# EAGLE board LSS Pro V0.2 BOTTOM (EAGLE 7.6.0)
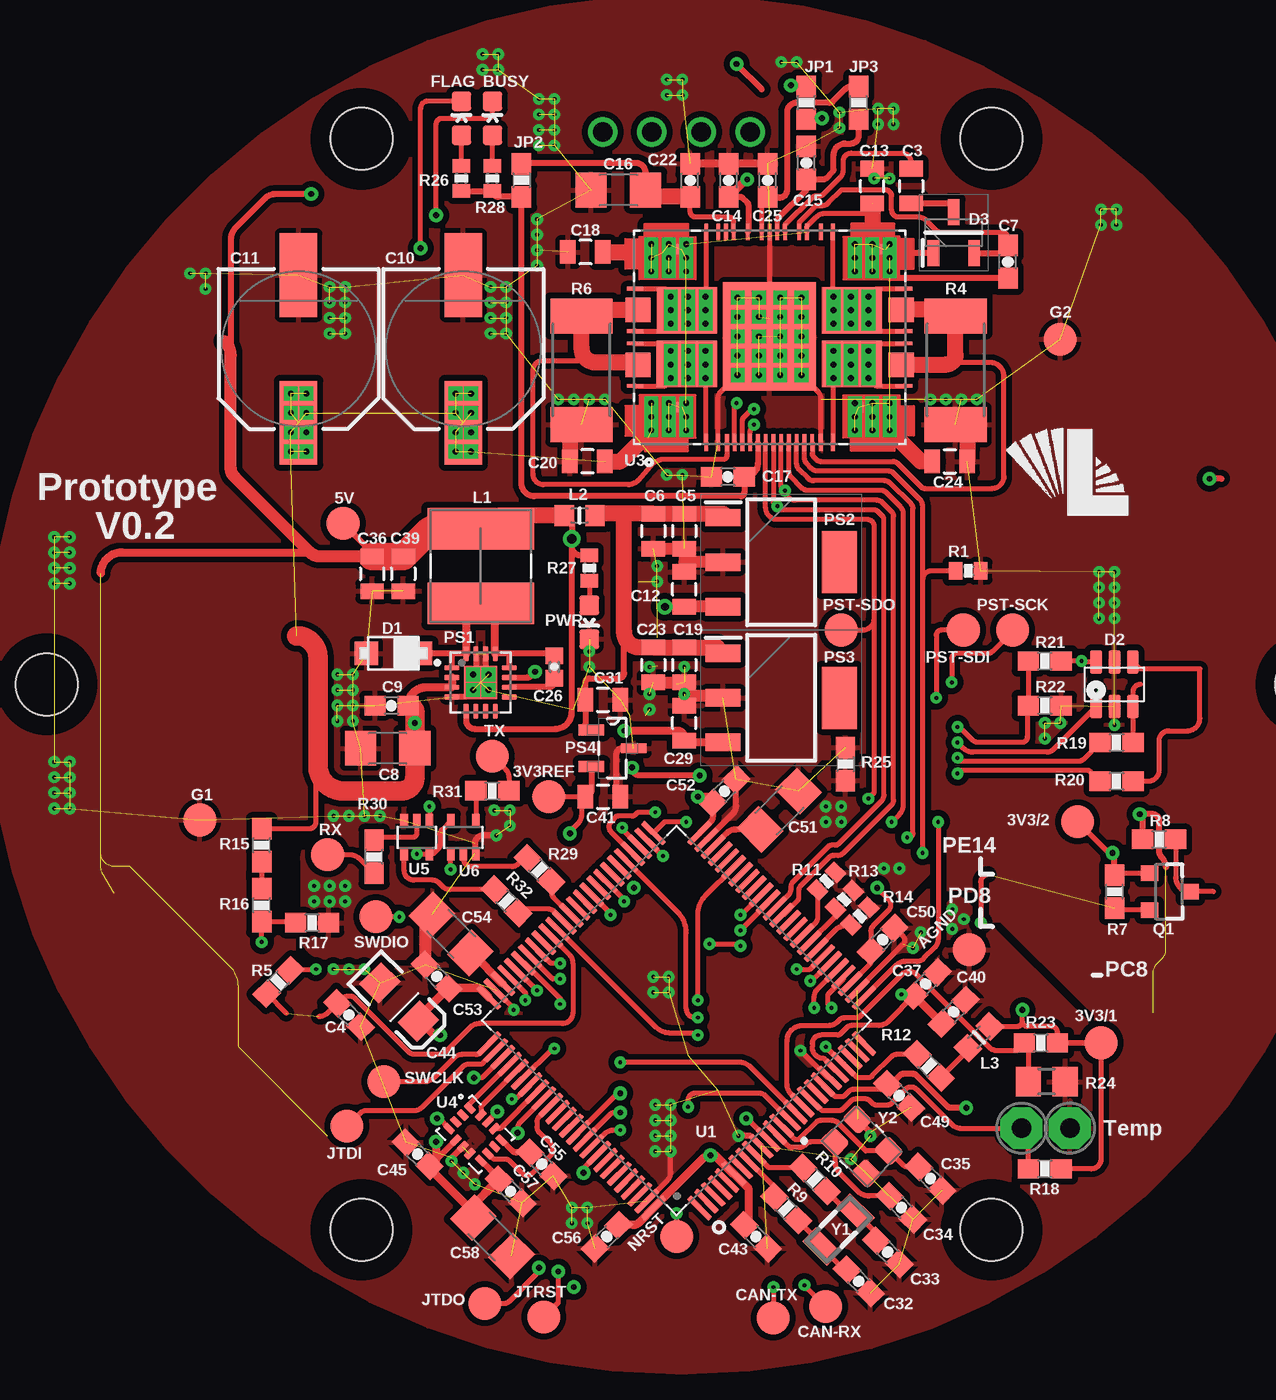
[diagram p2: board, top side]
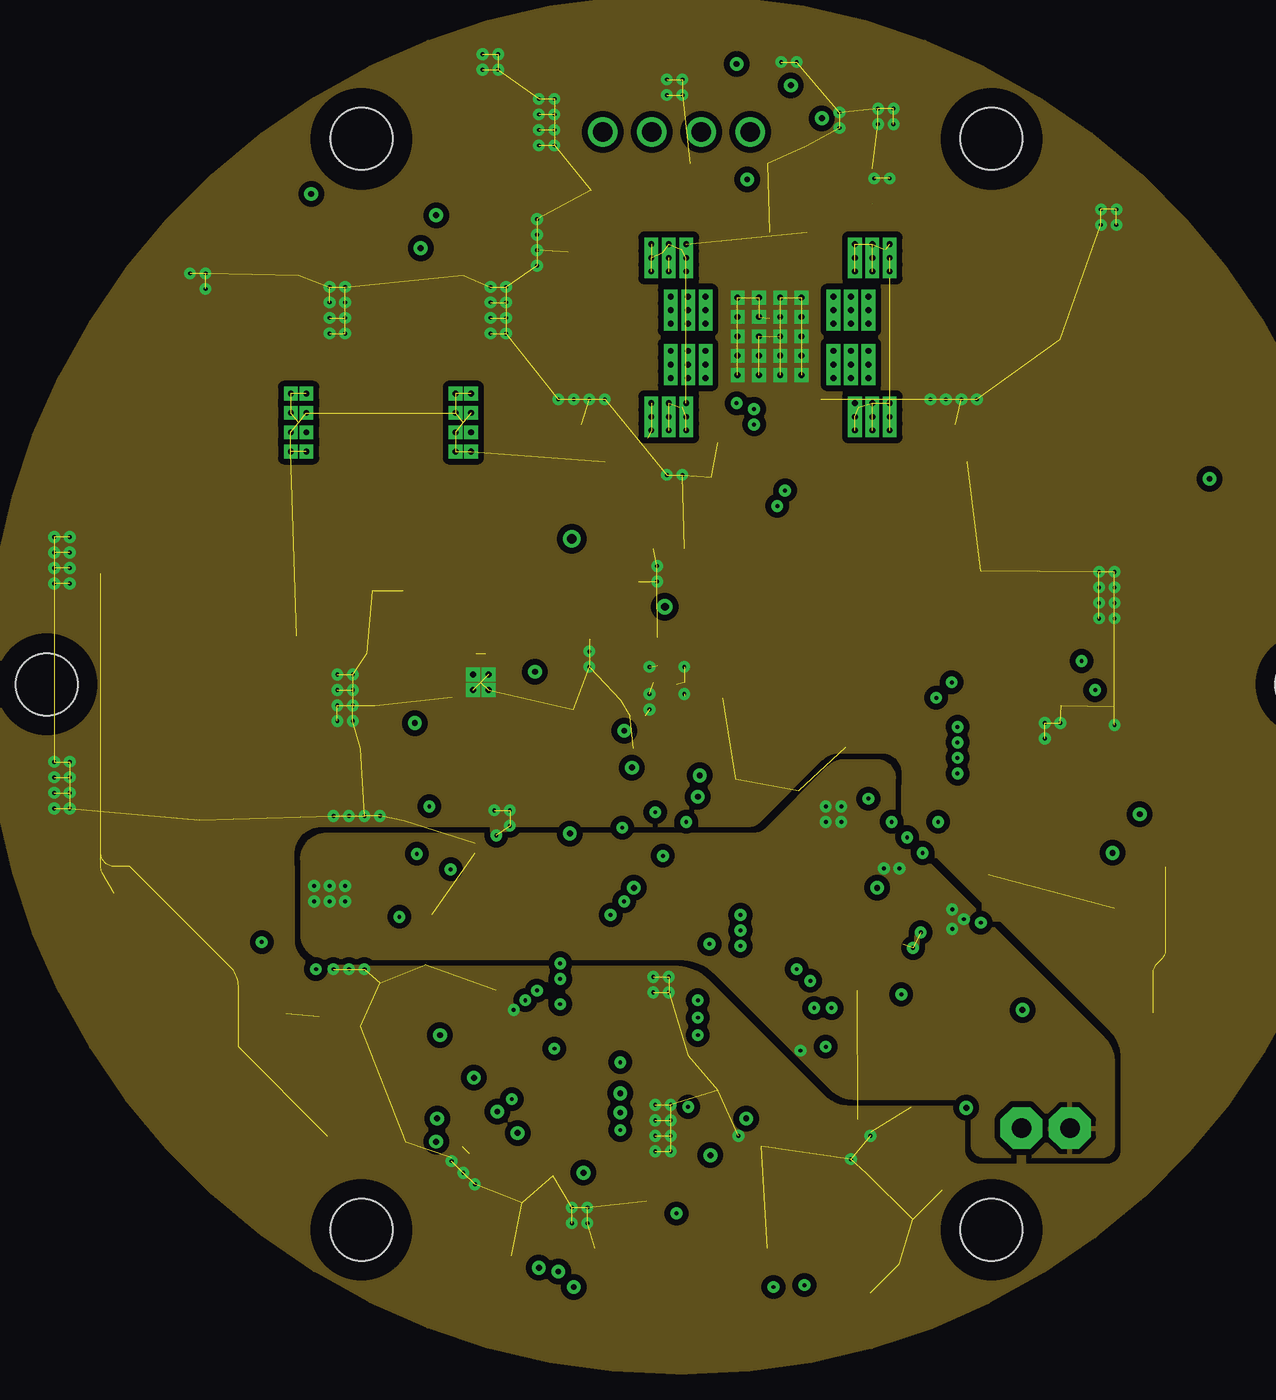
[diagram p3: board, inner layer Route2]
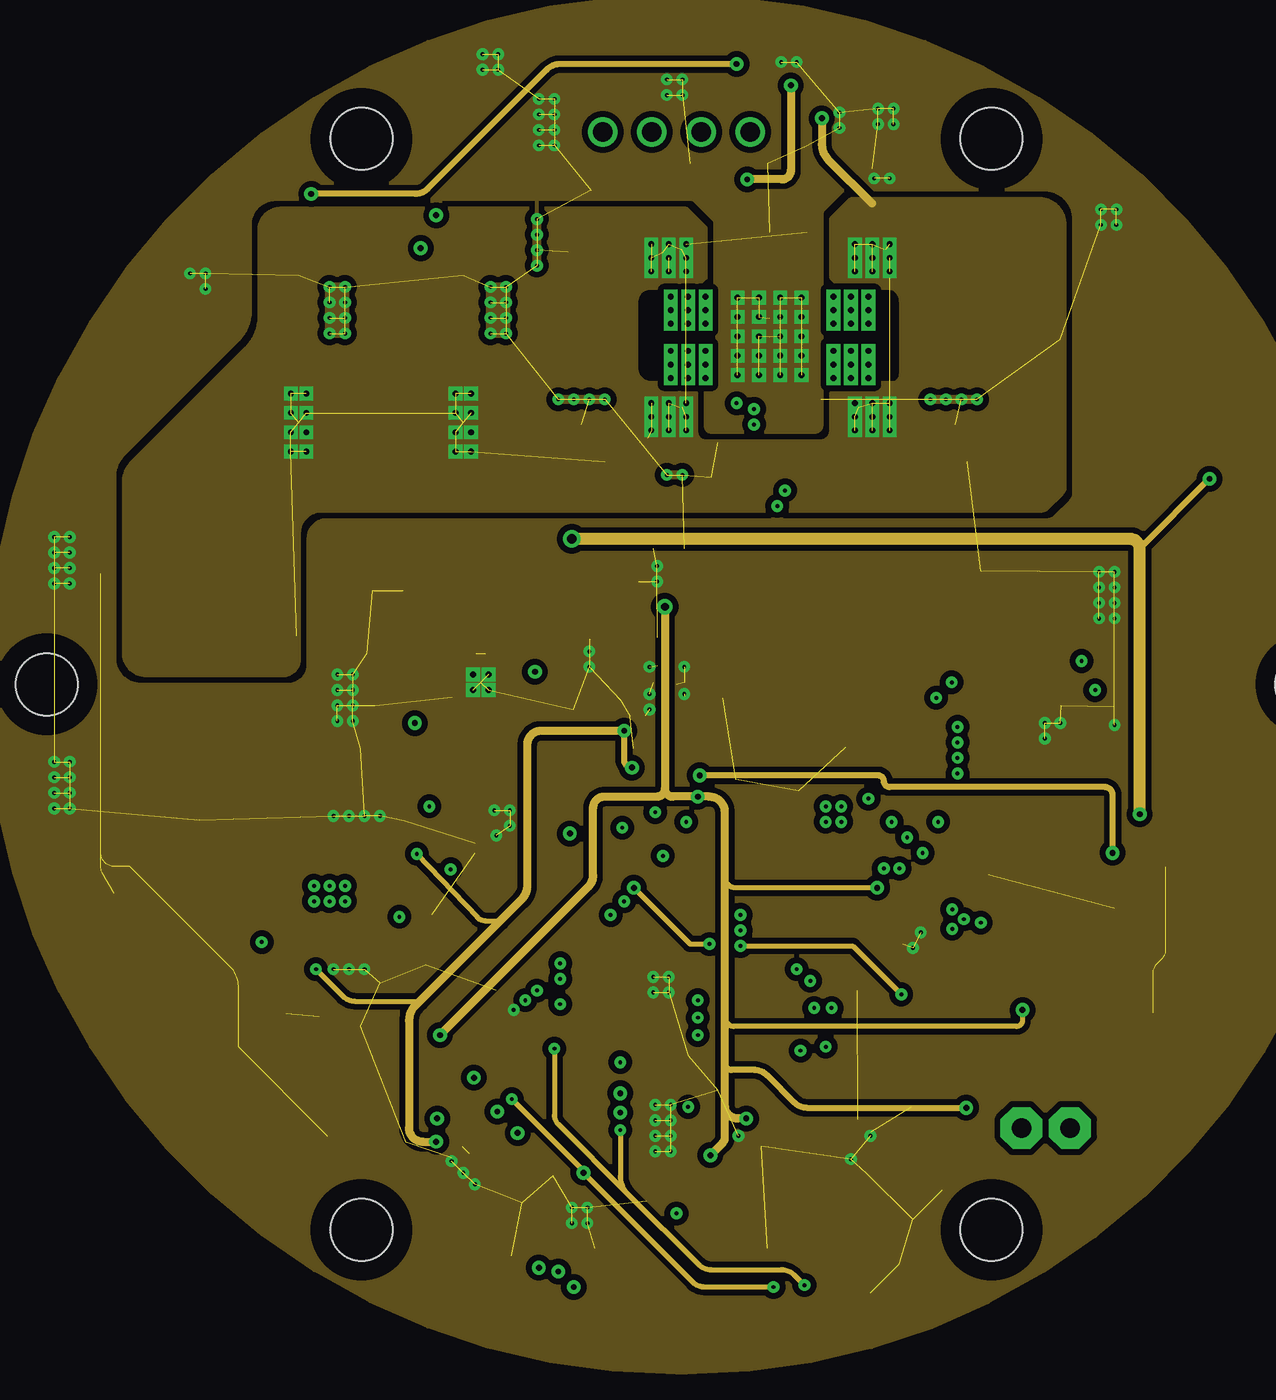
[diagram p4: board, inner layer Route15]
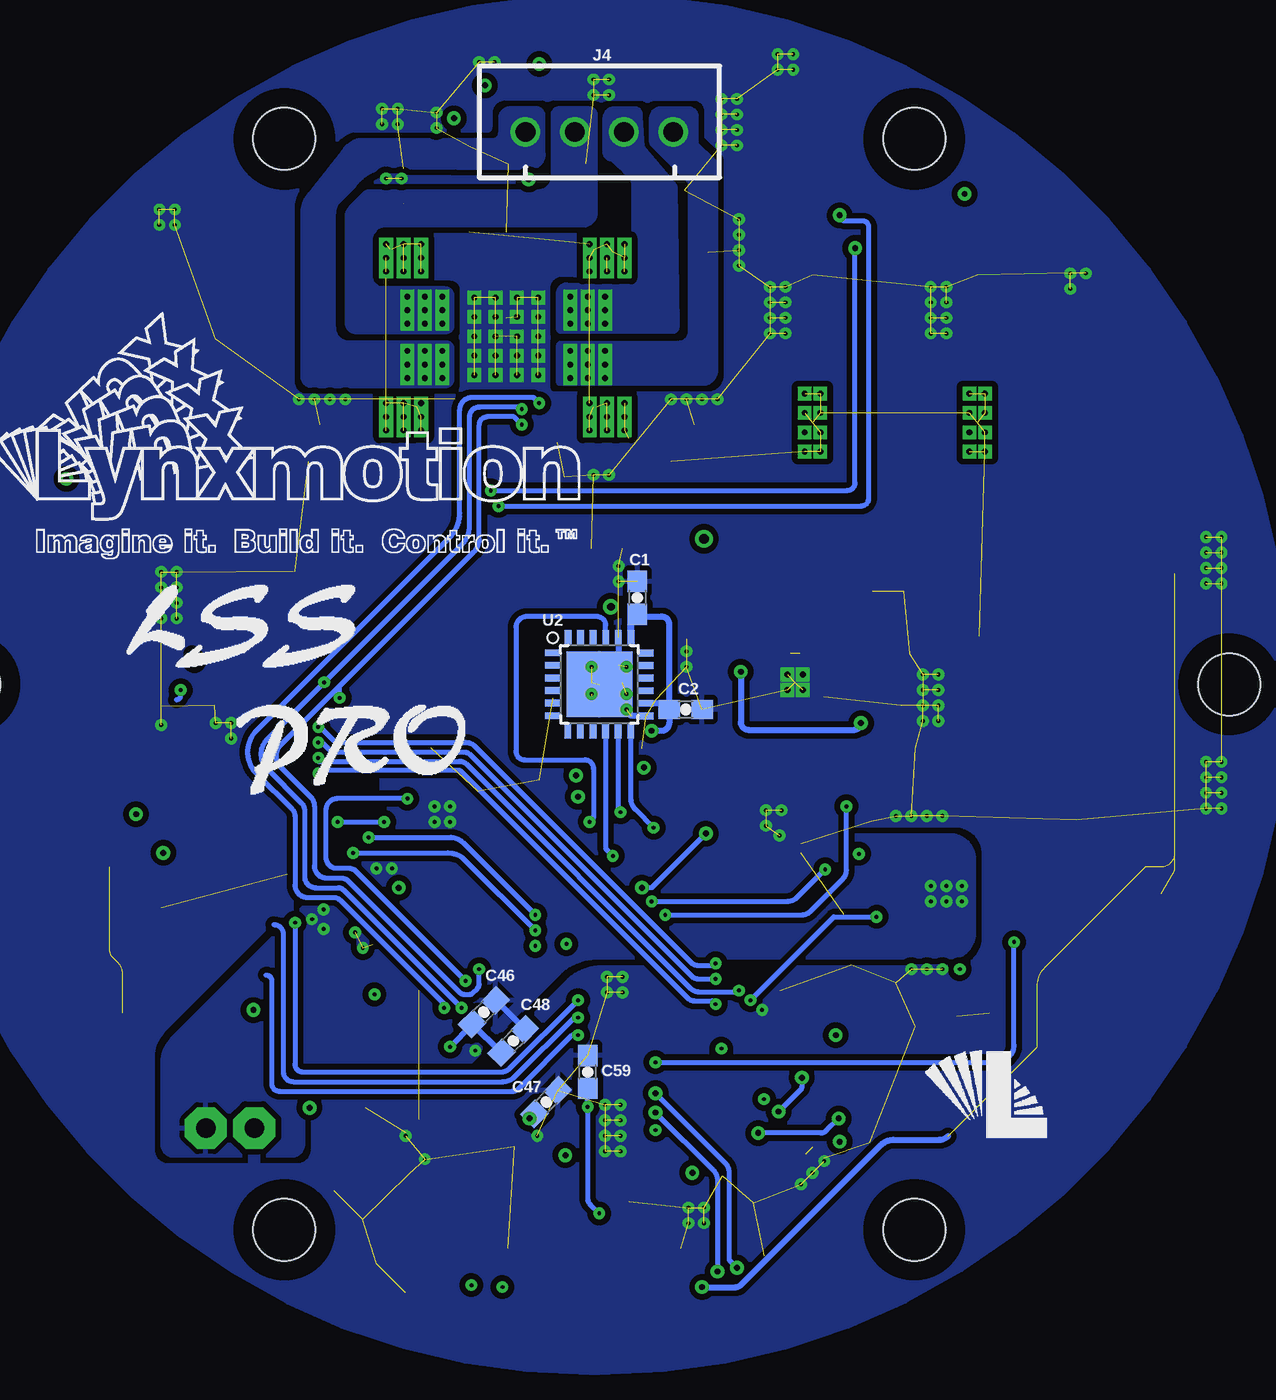
[diagram p5: board, bottom side, seen from below]

No outline drawn. Coordinates in mm, seen from the top.
Copper layers ((1*2)*(15*16)): Top 0.035mm / dielectric 0.2352mm / Route2 0.035mm / dielectric 38mil / Route15 0.035mm / dielectric 0.2352mm / Bottom 0.035mm
Design rules "default *": minimum track width 10mil, minimum drill 0.2mm, track to track 0.1mm, track to pad 0.1mm, pad to pad 0.1mm, via to via 0.1mm, smd to smd 0.1mm, copper to edge 40mil, drill to drill 8mil, minimum pad ring 10mil, minimum via ring 8mil, stop-mask expansion 4mil, vias tented up to drill 25mil, thermal gap 10mil
Net classes: 1 vcc: width 0.305 mm; 2 Power: width 0.203 mm, drill 0.305 mm, clearance 0.152 mm to class 0, clearance 0.152 mm to class 1, clearance 0.152 mm; 3 usb diff pairs: width 0.254 mm
Holes 3.2 mm at 51.75,63.65 19.25,63.65 19.25,7.35 51.75,7.35 3,35.5 68,35.5
tRestrict: 1 lines

## Footprints (pad centres in the part's own frame; a part is rotated, then mirrored left to right if it is on the bottom)
TP17R = smd 1.7 x 1.7: TP 0,0
TP-040 = drill 1.016 pad 2.159 octagon: 1 0,0
LED-0603 = smd 1 x 1: A 0,-0.877; C 0,0.877
0603-CAP = smd 1.1 x 1: 1 -0.85,0; 2 0.85,0
0805 = smd 0.8 x 1.2: 1 -0.9,0; 2 0.9,0
1206 = smd 1.6 x 1.8: 1 -1.4,0; 2 1.4,0
CSV-E/F = smd 4.318 x 1.93: + -3.81,0; - 3.81,0
0402-CAP = smd 0.85 x 0.9: 1 -0.58,0; 2 0.58,0
EIA3216 = smd 1.4 x 1.6: A 1.4,0; C -1.4,0
SOD123W = smd 1.2 x 1.2: 1 -1.4,0; 2 1.4,0
SOT-23-6L = smd 0.6 x 1.2: 1 -0.95,-1.15; 2 0,-1.15; 3 0.95,-1.15; 4 0.95,1.15; 5 0,1.15; 6 -0.95,1.15
SOT105P242X150-3N = smd 1.35 x 0.6: 1 -1.05,1.05; 2 -1.05,-1.05; 3 1.05,0
JST-XH-04-PACKAGE-ROUND-PAD = drill 1.016: 1 -3.81,0; 2 -1.27,0; 3 1.27,0; 4 3.81,0
0603-RES = smd 1.1 x 1: 1 -0.85,0; 2 0.85,0
WE-PD2_5848/5820 = smd 2.15 x 5.5: 1 -1.925,0; 2 1.925,0
L0603 = smd 1 x 1.1: 1 -0.794,0; 2 0.794,0
QFN16 = smd 0.76 x 0.26: 1 -1.485,0.75; 2 -1.485,0.25; 3 -1.485,-0.25; 4 -1.485,-0.75; 9 1.485,-0.75; 10 1.485,-0.25; 11 1.485,0.25; 12 1.485,0.75 | smd 0.26 x 0.76: 5 -0.75,-1.485; 6 -0.25,-1.485; 7 0.25,-1.485; 8 0.75,-1.485; 13 0.75,1.485; 14 0.25,1.485; 15 -0.25,1.485; 16 -0.75,1.485 | smd 1.7 x 1.7: 17 0,0
SOT230P700X165-4N = smd 1.8 x 0.9: 1 -3,2.3; 2 -3,0; 3 -3,-2.3 | smd 1.8 x 3.2: 4 3,0
SOT95P237X112-3N = smd 1.321 x 0.559: 1 -1.092,0.94; 2 -1.092,-0.94 | smd 1.321 x 0.508: 3 1.092,0
SOT23-3 = smd 0.8 x 0.9: 1 -0.95,-1; 2 0.95,-1; 3 0,1.1
0402-RES = smd 0.7 x 0.9: 1 -0.65,0; 2 0.65,0
R2512 = smd 1.8 x 3.2: 1 -2.8,0; 2 2.8,0
R0805 = smd 1.3 x 1.5: 1 -0.95,0; 2 0.95,0
LQFP100 = smd 1.56 x 0.28: 1 -7.68,6; 2 -7.68,5.5; 3 -7.68,5; 4 -7.68,4.5; 5 -7.68,4; 6 -7.68,3.5; 7 -7.68,3; 8 -7.68,2.5; 9 -7.68,2; 10 -7.68,1.5; 11 -7.68,1; 12 -7.68,0.5; 13 -7.68,0; 14 -7.68,-0.5; 15 -7.68,-1; 16 -7.68,-1.5; 17 -7.68,-2; 18 -7.68,-2.5; 19 -7.68,-3; 20 -7.68,-3.5; 21 -7.68,-4; 22 -7.68,-4.5; 23 -7.68,-5; 24 -7.68,-5.5; 25 -7.68,-6; 51 7.68,-6; 52 7.68,-5.5; 53 7.68,-5; 54 7.68,-4.5; 55 7.68,-4; 56 7.68,-3.5; 57 7.68,-3; 58 7.68,-2.5; 59 7.68,-2; 60 7.68,-1.5; 61 7.68,-1; 62 7.68,-0.5; 63 7.68,0; 64 7.68,0.5; 65 7.68,1; 66 7.68,1.5; 67 7.68,2; 68 7.68,2.5; 69 7.68,3; 70 7.68,3.5; 71 7.68,4; 72 7.68,4.5; 73 7.68,5; 74 7.68,5.5; 75 7.68,6 | smd 0.28 x 1.56: 26 -6,-7.68; 27 -5.5,-7.68; 28 -5,-7.68; 29 -4.5,-7.68; 30 -4,-7.68; 31 -3.5,-7.68; 32 -3,-7.68; 33 -2.5,-7.68; 34 -2,-7.68; 35 -1.5,-7.68; 36 -1,-7.68; 37 -0.5,-7.68; 38 0,-7.68; 39 0.5,-7.68; 40 1,-7.68; 41 1.5,-7.68; 42 2,-7.68; 43 2.5,-7.68; 44 3,-7.68; 45 3.5,-7.68; 46 4,-7.68; 47 4.5,-7.68; 48 5,-7.68; 49 5.5,-7.68; 50 6,-7.68; 76 6,7.68; 77 5.5,7.68; 78 5,7.68; 79 4.5,7.68; 80 4,7.68; 81 3.5,7.68; 82 3,7.68; 83 2.5,7.68; 84 2,7.68; 85 1.5,7.68; 86 1,7.68; 87 0.5,7.68; 88 0,7.68; 89 -0.5,7.68; 90 -1,7.68; 91 -1.5,7.68; 92 -2,7.68; 93 -2.5,7.68; 94 -3,7.68; 95 -3.5,7.68; 96 -4,7.68; 97 -4.5,7.68; 98 -5,7.68; 99 -5.5,7.68; 100 -6,7.68
QFN24 = smd 0.8 x 0.35: 1 -2.4,1.63; 2 -2.4,0.98; 3 -2.4,0.33; 4 -2.4,-0.32; 5 -2.4,-0.97; 6 -2.4,-1.62; 13 2.4,-1.63; 14 2.4,-0.98; 15 2.4,-0.33; 16 2.4,0.32; 17 2.4,0.97; 18 2.4,1.62 | smd 0.35 x 0.8: 7 -1.63,-2.4; 8 -0.98,-2.4; 9 -0.33,-2.4; 10 0.32,-2.4; 11 0.97,-2.4; 12 1.62,-2.4; 19 1.63,2.4; 20 0.98,2.4; 21 0.33,2.4; 22 -0.32,2.4; 23 -0.97,2.4; 24 -1.62,2.4 | smd 3.4 x 3.4: 25 0,0
IC_POWERSTEP01 = smd 0.5 x 0.5: 1 -3.6,4.65; 23 -3.6,-4.6; 43 4.55,-5.9; 66 4.55,4.6 | smd 0.86 x 0.19: 7 -5.435,3.27; 8 -5.435,2.65; 9 -5.435,2.2; 10 -5.435,1.8; 11 -5.435,1.4; 12 -5.435,1; 13 -5.435,0.6; 14 -5.435,0.2; 15 -5.435,-0.2; 16 -5.435,-0.6; 17 -5.435,-1; 18 -5.435,-1.4; 19 -5.435,-1.8; 20 -5.435,-2.2; 21 -5.435,-2.65; 22 -5.435,-3.27; 53 5.435,-3.27; 54 5.435,-2.65; 55 5.435,-1.93; 56 5.435,-1.53; 57 5.435,-0.8; 58 5.435,-0.4; 59 5.435,0; 60 5.435,0.4; 61 5.435,1.13; 62 5.435,1.85; 63 5.435,2.25; 64 5.435,2.65; 65 5.435,3.27 | smd 0.19 x 0.86: 33 -2.51,-6.935; 37 -0.32,-6.935; 38 0.32,-6.935; 42 2.51,-6.935; 76 2.51,6.935; 80 0.32,6.935; 81 -0.32,6.935; 85 -2.51,6.935 | smd 1.26 x 1.3: 34 -1.42,-6.79; 39 1.42,-6.79; 77 1.42,6.79; 82 -1.42,6.79 | smd 2.4 x 3.1: EPAD3 -1.38,-4.26; EPAD4 1.38,-4.26; EPAD7 1.38,4.26; EPAD8 -1.38,4.27 | smd 5.6 x 4.8: EPAD9 0.04,0
PQFN50P250X300X97-14N = smd 0.61 x 0.35: 1 -1.16,0.75; 2 -1.16,0.25; 3 -1.16,-0.25; 4 -1.16,-0.75; 8 1.16,-0.75; 9 1.16,-0.25; 10 1.16,0.25; 11 1.16,0.75 | smd 0.35 x 0.61: 5 -0.5,-0.91; 6 0,-0.91; 7 0.5,-0.91; 12 0.5,0.91; 13 0,0.91; 14 -0.5,0.91
SC70-5 = smd 0.4 x 0.7: 1 -0.65,-0.85; 2 0,-0.85; 3 0.65,-0.85; 4 0.65,0.85; 5 -0.65,0.85
NX3215SA = smd 1 x 1.8: 1 -1.25,0; 2 1.25,0
OSCCC320X250X60N = smd 1.21 x 1.06: 1 -1.15,-0.825; 2 1.15,-0.825; 3 1.15,0.825; 4 -1.15,0.825

## Placement (x,y rotation side)
3V3/1  TPTP17R  [TP17R]  57.4,17 0 top
3V3/2  TPTP17R  [TP17R]  56.2,28.4 0 top
3V3REF  TPTP17R  [TP17R]  28.9,29.7 0 top
5V  TPTP17R  [TP17R]  18.3,43.8 0 top
$1_188_$_2019-07-17_16-41-47  TP-040  [TP-040]  53.3,12.6 0 top
$1_189_$_2019-07-17_16-41-47  TP-040  [TP-040]  55.8,12.6 0 top
AGND  TPTP17R  [TP17R]  50.6,21.8 0 top
BUSY  Red  [LED-0603]  26,64.7 0 top
C1  100nF  [0603-CAP]  33.54,39.96 270 bottom
C2  10uF  [0603-CAP]  31.04,34.2 0 bottom
C3  47nF/100V  [0805]  47.6,61.2 270 top
C4  100nF  [0603-CAP]  18.6,18.44 315 top
C5  10uF  [0805]  35.9,43.4 270 top
C6  10uF  [0805]  34.3,43.4 270 top
C7  470nF/25V  [0603-CAP]  52.6,57.3 90 top
C8  10uF  [1206]  20.6,32.2 180 top
C9  0.1uF  [0603-CAP]  20.8,34.4 180 top
C10  68uF/63V  [CSV-E/F]  24.5,52.8 90 top
C11  68uF/63V  [CSV-E/F]  16,52.8 90 top
C12  22uF  [0805]  35.9,40.4 90 top
C13  220nF/100V  [0805]  45.6,61.2 90 top
C14  470nF/25V  [0603-CAP]  38.2,61.5 90 top
C15  100nF/100V  [0603-CAP]  42.2,62.4 90 top
C16  22uF/6.3V  [1206]  32.5,61 180 top
C17  100nF/6.3V  [0603-CAP]  38.15,46.2 180 top
C18  220nF/100V  [0805]  30.8,57.8 180 top
C19  10uF  [0805]  35.9,36.5 270 top
C20  220nF/100V  [0805]  30.9,47 180 top
C22  100nF/4V  [0603-CAP]  36.2,61.5 90 top
C23  10uF  [0805]  34.3,36.5 270 top
C24  220nF/100V  [0805]  49.6,47 0 top
C25  100nF/25V  [0603-CAP]  40.2,61.5 90 top
C26  22nF  [0402-CAP]  29.2,36.4 270 top
C29  22uF  [0805]  35.9,33.5 90 top
C31  1uF  [0805]  31.7,34.7 0 top
C32  2pF  [0603-CAP]  44.9,4.7 315 top
C33  2pF  [0603-CAP]  46.4,6.2 315 top
C34  4.3pF  [0603-CAP]  47.1,8.5 315 top
C35  4.3pF  [0603-CAP]  48.6,10 315 top
C36  22uF  [0805]  19.8,41.2 270 top
C37  100nF  [0603-CAP]  48.36,20.04 45 top
C39  22uF  [0805]  21.4,41.2 270 top
C40  1uF  [0603-CAP]  49.8,18.6 45 top
C41  1uF  [0805]  31.7,29.7 0 top
C43  1uF  [0603-CAP]  39.6,7 315 top
C44  10uF  [EIA3216]  21.19,19.11 315 top
C45  10nF  [0603-CAP]  22.14,11.26 135 top
C46  100nF  [0603-CAP]  41.46,18.58 45 bottom
C47  100nF  [0603-CAP]  38.24,13.94 45 bottom
C48  1uF  [0603-CAP]  39.94,17.1 45 bottom
C49  100nF  [0603-CAP]  46.99,14.27 315 top
C50  100nF  [0603-CAP]  46.13,22.33 45 top
C51  2.2uF  [1206]  40.8,29 45 top
C52  100nF  [0603-CAP]  37.97,29.99 45 top
C53  100nF  [0603-CAP]  23.13,20.43 135 top
C54  2.2uF  [1206]  23.87,22.63 135 top
C55  100nF  [0603-CAP]  28.54,10.74 315 top
C56  100nF  [0603-CAP]  31.9,7 225 top
C57  100nF  [0603-CAP]  26.94,9.34 315 top
C58  2.2uF  [1206]  26,7 315 top
C59  100nF  [0603-CAP]  36.1,15.5 90 bottom
CAN-RX  TPTP17R  [TP17R]  43.2,3.4 0 top
CAN-TX  TPTP17R  [TP17R]  40.5,2.8 0 top
D1  PMEG4030ER  [SOD123W]  20.9,37.1 180 top
D2  [SOT-23-6L]  58.1,35.5 0 top
D3  BAR43SFILM  [SOT105P242X150-3N]  49.8,58.8 90 top
FLAG  Blue  [LED-0603]  24.4,64.7 0 top
G1  TPTP17R  [TP17R]  10.9,28.5 0 top
G2  TPTP17R  [TP17R]  55.3,53.3 0 top
J4  JST-XH-04-PIN-ROUND-PAD  [JST-XH-04-PACKAGE-ROUND-PAD]  35.5,64 0 bottom
JP1  0  [0603-RES]  42.2,65.5 90 top
JP2  0  [0603-RES]  27.5,61.5 270 top
JP3  0  [0603-RES]  44.9,65.5 90 top
JTDI  TPTP17R  [TP17R]  18.5,12.7 0 top
JTDO  TPTP17R  [TP17R]  25.6,3.55 0 top
JTRST  TPTP17R  [TP17R]  28.65,2.85 0 top
L1  4.7uH  [WE-PD2_5848/5820]  25.4,41.6 90 top
L2  EXC3BP  [L0603]  30.5,44.2 0 top
L3  EXC3BP  [L0603]  51.1,17.29 225 top
NRST  TPTP17R  [TP17R]  35.5,7 0 top
PS1  TS30042-M050QFNR  [QFN16]  25.4,35.6 0 top
PS2  AP7361C-33E-13  [SOT230P700X165-4N]  40.9,41.8 0 top
PS3  AP7361C-33E-13  [SOT230P700X165-4N]  40.9,34.8 0 top
PS4  REF3133AIDBZR  [SOT95P237X112-3N]  32.2,32.2 0 top
PST-SCK  TPTP17R  [TP17R]  52.84,38.3 0 top
PST-SDI  TPTP17R  [TP17R]  50.3,38.3 0 top
PST-SDO  TPTP17R  [TP17R]  44,38.3 0 top
PWR  Green  [LED-0603]  31,38.7 180 top
Q1  BSS138  [SOT23-3]  60.9,24.8 270 top
R1  10K  [0402-RES]  50.55,41.35 0 top
R4  0.1Ohm/2W  [R2512]  49.9,51.7 90 top
R5  10K  [0603-RES]  14.96,20.14 45 top
R6  0.1Ohm/2W  [R2512]  30.6,51.7 90 top
R7  1K  [0603-RES]  58.1,24.8 90 top
R8  1K  [0603-RES]  60.4,27.5 180 top
R9  0  [0603-RES]  41.16,8.46 135 top
R10  0  [0603-RES]  42.64,9.96 135 top
R11  10K  [0402-RES]  43.24,25.34 225 top
R12  0  [0603-RES]  48.53,15.81 135 top
R13  10K  [0402-RES]  44.16,24.4 225 top
R14  10K  [0402-RES]  44.96,23.54 225 top
R15  100K  [0603-RES]  14.1,27.2 90 top
R16  22K  [0603-RES]  14.1,24.1 90 top
R17  10K  [0603-RES]  16.7,23.2 180 top
R18  10K  [0603-RES]  54.5,10.5 0 top
R19  22  [0603-RES]  58.2,32.5 180 top
R20  22  [0603-RES]  58.2,30.5 180 top
R21  430K  [0603-RES]  54.5,36.7 180 top
R22  620K  [0603-RES]  54.5,34.4 0 top
R23  10K  [0603-RES]  54.3,17 0 top
R24  NTC_B574B57421V2102H062  [R0805]  54.6,15 180 top
R25  0  [0603-RES]  44.22,31.38 270 top
R26  470  [0402-RES]  24.4,61.6 270 top
R27  1K  [0402-RES]  31,41.5 90 top
R28  470  [0402-RES]  26,61.6 270 top
R29  0  [0603-RES]  28.43,25.93 135 top
R30  0  [0603-RES]  19.9,26.6 90 top
R31  137  [0603-RES]  26,30 0 top
R32  137  [0603-RES]  26.73,24.31 315 top
RX  TPTP17R  [TP17R]  17.5,26.7 0 top
SWCLK  TPTP17R  [TP17R]  20.4,15 0 top
SWDIO  TPTP17R  [TP17R]  20,23.5 0 top
TX  TPTP17R  [TP17R]  26,31.8 0 top
U1  STM32F413VGT6  [LQFP100]  35.5,18.15 135 top
U2  AEAT-8800-Q24  [QFN24]  35.5,35.5 0 bottom
U3  POWERSTEP01  [IC_POWERSTEP01]  40.3,53.4 90 top
U4  ICM-20600  [PQFN50P250X300X97-14N]  25.12,12.28 315 top
U5  74LVC1G126DCK  [SC70-5]  24.5,27.6 0 top
U6  74LVC1G126DCK  [SC70-5]  22.1,27.6 180 top
Y1  NX3215SA-32.768KHZ-EXS00A-MU00525  [NX3215SA]  43.86,7.38 225 top
Y2  NX3225SA-16.000M-STD-CRS-2  [OSCCC320X250X60N]  45.06,11.66 315 top

## Tracks (layer width: path | path; a pad name or v marks a point on that pad's centre or on a via)
5V
  Top 0.305: 32.8,38.2 32.8,36.1 arc-90 32.5,35.8 31,35.8 arc90 30.8,35.6 C31.1 30.8,33.45 arc90 PS4.1
  Top 0.813: PS2.1 37.9,44.3 C5.1 C6.1 32.5,44.3 | PS3.1 37.6,37.4 C19.1 C23.1 33.6,37.4 arc-90 32.8,38.2 32.8,44 arc90 32.5,44.3 | 32.5,44.3 31.54,44.3 arc45 L2.2
5VREG  (via drill 0.3, 0.5)  (16 unrouted)
  Top 0.305: PS1.5 24.65,33.65 arc90 25.1,33.2 29.24,33.2 arc90 30.1,34.06 30.1,42.6 | R27.2 30.55,42.15 arc-90 30.1,42.6 | R8.2 59.55,28.65 arc90 v59.4,28.8 60.06,28.8 arc-90 60.4,28.46 60.4,26.91 arc45 60.55,26.55 arc-45 60.75,26.07 | 30.1,42.6 v30.1,43 30.1,43.81 arc90 L2.1 | 63.62,46.1 v63,46.1 | 39.9,66.2 v38.6,67.5 | v16.65,60.8 14.81,60.8 arc45 14.28,60.58 12.75,59.05 arc45 12.5,58.45 12.5,52.48 | 5V.TP 20,42.1 20.3,42.1 | 30.25,4.35 v30.2,4.4
  Top 0.406: 5.8,41.22 arc-90 6.89,42.31 16.59,42.31
  Top 0.61: C36.1 17.09,42.1 arc-45 16.59,42.31 12.68,46.22 arc-45 12.5,46.65 12.5,52.48 arc45 12.2,53.2
  Top 0.813: L2.1 26.34,44.2 arc45 25.89,44.01 L1.2
  Top 1.422: L1.2 23.09,43.52 arc45 22.64,43.34 C39.1 20.3,42.1 C36.1
  Route15 0.305: v63,46.1 59.4,42.5 | v38.6,67.5 29.52,67.5 arc45 28.8,67.2 22.66,61.06 arc-45 22.03,60.8 v16.65,60.8
  Route15 0.61: v59.4,28.8 59.4,42.5 arc90 58.9,43 v30.1,43
  Bottom 0.305: 17.51,12.19 arc45 17.96,12 20.33,12 arc-45 20.96,11.74 28.18,4.52 arc45 28.47,4.4 v30.2,4.4
+3V3/1  (via drill 0.3, 0.4)
  Top 0.254: v39.1,13.1 39.14,13.1 U1.11 | U1.19 43.61,14.29 arc45 43.77,14.22 44.03,14.22 arc45 44.18,14.28 44.41,14.51 arc-45 44.63,14.6 46.06,14.6 46.36,14.9 C49.1 | R23.2 55.15,17.55 arc90 54.85,17.85 53.6,17.85 arc-90 53.35,18.1 | L3.1 arc90 L3.1 53.1,17.85 arc90 53.35,18.1 | 53.35,18.1 v53.35,18.7 | v45.85,25 46.42,24.43 arc-90 46.42,23.82 45.64,23.04 arc45 45.53,22.77 C50.1 45.53,21.24 arc-45 45.44,21.02 U1.28 | 3V3/1.TP R23.2 | R23.2 57.3,17 57.4,16.9 57.4,11 arc-90 56.9,10.5 R18.2
  Top 0.305: C44.A arc45 22.26,18.36 | C49.1 46.39,14.89 | v50.45,13.65 49.67,13.65 arc-45 49.47,13.73 47.87,15.34 arc45 47.71,15.4 47.19,15.4 arc45 47.03,15.34 46.57,14.87 C49.1 | 46.52,15 C49.1 | C52.1 37.37,28.66 arc-45 37.26,28.4 U1.50
  Top 0.406: C56.1 33.26,7.6 arc45 33.56,7.72 U1.100 36.88,11.05 arc-90 37.6,11.05 38.4,10.25 U1.6 | U1.6 39.2,9.5 39.2,7.8 C43.1 | 22.26,18.36 C53.1 25.34,19.83 U1.75 25.37,19.8 23.7,19.8 22.3,18.4 22.3,18.1 23,17.4 v23.3,17.4 | PS2.3 v34.9,39.5 | U1.6 37.5,11.2 v37.25,11.2 | v36.6,29.7 37.06,29.7 arc-90 C52.1
  Top 0.61: PS2.3 C12.1
  Route15 0.254: 38,18.3 arc90 38.45,17.85 53.05,17.85 arc90 53.35,18.15 v53.35,18.7 | v45.85,25 38.55,25 arc-90 38,25.55
  Route15 0.305: 38,15.95 arc90 38.35,15.6 39.5,15.6 arc-45 40.18,15.32 41.59,13.91 arc45 42.21,13.65 v50.45,13.65
  Route15 0.406: v34.9,39.5 34.9,30.11 | v23.3,17.4 30.96,25.06 arc45 31.2,25.63 31.2,29.13 arc-90 31.77,29.7 34.49,29.7 arc90 34.9,30.11 | v37.25,11.2 37.87,11.82 arc45 38,12.14 38,13.75 | 38,13.75 38,15.95 38,18.3 38,25.55 38,28.9 arc90 37.2,29.7 v36.6,29.7 35.31,29.7 arc-90 34.9,30.11 | v39.1,13.1 38.65,13.1 arc-90 38,13.75
  Bottom 0.254: C47.1 38.86,13.34 v39.1,13.1
+3V3/2  (via drill 0.2, 0.3)
  Top 0.254: Q1.1 58.2,25.75 arc90 R7.2 | U5.5 23.39,27.99 arc45 23.3,27.77 23.3,27.23 arc-45 23.21,27.01 22.95,26.75 U6.5 v22.1,26.75 | R5.2 15.62,20.8 v16.9,20.8 | 3V3/2.TP 57.8,26.8 v58,26.8
  Top 0.305: C57.1 26.34,10 U4.8 26.3,10.04 26.3,10 24.8,8.5 | C45.1 22.79,10.66 U4.5 | R7.2 58.1,26.7 arc90 v58,26.8 | v36.7,30.8 33.6,30.8 arc-90 v33.2,31.2
  Top 0.406: C57.1 25.01,8.61 C58.1 24.99,7.99 | PS3.3 36,32.5 arc-90 C29.1 35.9,32.75 arc90 35.55,33.1 v32.8,33.1 | v23.1,11.9 23.1,11.02 arc-90 C45.1 22.74,10.56 24.8,8.5
  Route15 0.254: v22.1,26.75 25.23,23.47 arc45 25.63,23.3 26.4,23.3 | v16.9,20.8 18.29,19.41 arc45 18.91,19.15 22.25,19.15
  Route15 0.305: v58,26.8 58,29.8 arc90 57.6,30.2 46.5,30.2 arc-90 46.2,30.5 arc90 45.9,30.8 v36.7,30.8 | v32.8,33.1 32.8,31.6 arc90 v33.2,31.2
  Route15 0.406: v32.8,33.1 28.51,33.1 arc90 27.8,32.39 27.8,25.15 arc-45 27.48,24.39 26.4,23.3 22.25,19.15 22.02,18.92 arc45 21.7,18.15 21.7,12.6 arc90 22.4,11.9 v23.1,11.9
  Bottom 0.305: U2.14 32.21,34.52 arc90 C2.1 31.89,33.7 | 31.89,33.7 31.89,33.51 arc90 32.3,33.1 v32.8,33.1 | C1.2 arc-90 33.87,38.78 U2.19 arc90 33.9,37.93 33.9,39 32.3,39 arc90 31.9,38.6 31.9,33.71 arc-90 31.89,33.7
+3V3/REF  (via drill 0.2, 0.3)
  Top 0.254: U1.21 43.11,16.2 43.08,16.2 arc-90 42.5,16.78 42.5,16.95 arc-90 42.95,17.4 43.81,17.4 arc45 43.97,17.46 44.29,17.79 arc-45 44.55,17.9 45.92,17.9 arc45 46.43,18.11 C37.1 47.7,19.5 v47.1,19.5 | 3V3REF.TP C41.1 | 31.11,30.01 30.6,29.5 30.6,28.78 arc-45 30.4,28.3 30,27.9 v30,27.8 | v37.2,22.1 38.7,22.1 v38.8,22
  Top 0.305: PS4.2 31.11,30.01 arc-90 C41.1
  Top 0.406: C37.1 C40.1
  Route15 0.254: v33.3,25 36.2,22.1 v37.2,22.1 | v38.8,22 44.6,22 v47.1,19.5
  Bottom 0.254: v30,27.8 32.8,25 v33.3,25
ADC-TEMPERATURE1
  Top 0.254: R24.2 53.65,16.8 arc90 R23.1 53.05,16.6 52.08,16.6 arc-45 51.6,16.8 47.85,20.55 arc90 47.15,20.55 44.9,18.3 arc45 44.9,18.3 44.19,18.3 arc45 43.87,18.17 43.77,18.07 arc-45 43.37,17.9 42.01,17.9 arc90 41.2,17.09 41.2,14.86 arc45 41.4,14.38 U1.16
ADC-TEMPERATURE2
  Top 0.254: U1.17 42.36,14.14 42.94,13.56 arc45 43.08,13.5 43.87,13.5 arc45 44.09,13.59 44.51,14.01 arc-45 44.73,14.1 45.28,14.1 arc-45 45.49,14.01 45.63,13.87 arc45 45.79,13.8 46.41,13.8 arc45 46.56,13.87 47.31,14.61 arc-90 47.89,14.61 49.73,12.77 arc45 50.14,12.6 $1_188_$_2019-07-17_16-41-47.1 arc-90 53.65,12.25 R18.1
ADC-VOLTAGE  (via drill 0.2)
  Top 0.254: R17.2 arc45 15.73,23.25 R16.1 v14.1,22.2 | U1.15 39.31,15.76 arc45 38.73,16 v32.6,16
  Bottom 0.254: v14.1,22.2 14.1,16.89 arc90 14.99,16 v32.6,16
AGND  (via drill 0.2)
  Top 0.254: U1.20 43.3,15.2 v41.9,16.6
  Bottom 0.305: C46.2 40.83,19.19 C48.2
  other vias: 44,29.2 43.2,29.2 43.2,28.4 44,28.4 46.2,26 47,26 17.6,25.1 16.8,25.1 16.8,24.3 17.6,24.3 49.72,22.88 50.32,23.38 49.72,23.88 18.4,25.1 18.4,24.3
  pour Route2 (isolate 0.305): 17.45,21.4 35.68,21.4 arc-45 37.59,20.61 43.56,14.64 arc45 44.62,14.2 50.39,14.2 arc-90 50.8,13.79 50.8,11.78 arc90 51.38,11.2 57.46,11.2 arc90 58,11.74 58,16 arc45 57.5,17.2 46.7,28 46.7,30.65 arc90 45.85,31.5 44.16,31.5 arc45 43.37,31.17 40.19,27.99 arc-45 39.49,27.7 17.42,27.7 arc90 16.2,26.48 16.2,22.65 arc90
  pour Top (isolate 0.305): 17.45,21.4 35.68,21.4 arc-45 37.59,20.61 43.56,14.64 arc45 44.62,14.2 50.39,14.2 arc-90 50.8,13.79 50.8,11.78 arc90 51.38,11.2 57.46,11.2 arc90 58,11.74 58,16 arc45 57.5,17.2 50.29,24.31 arc90 49.71,24.31 48.78,23.38 arc45 48.7,23.18 48.7,21.85 arc-90 48.25,21.4 46.8,21.4 44.59,19.19 arc-90 44.01,19.19 43.35,19.85 arc-90 43.35,20.55 48.41,25.71 arc90 48.41,26.29 46.7,28 46.7,30.65 arc90 45.85,31.5 44.16,31.5 arc45 43.37,31.17 40.19,27.99 arc-45 39.49,27.7 17.42,27.7 arc90 16.2,26.48 16.2,22.65 arc90
  pour Bottom (isolate 0.305): 17.45,21.4 35.68,21.4 arc-45 37.59,20.61 43.56,14.64 arc45 44.62,14.2 50.39,14.2 arc-90 50.8,13.79 50.8,11.78 arc90 51.38,11.2 57.46,11.2 arc90 58,11.74 58,16 arc45 57.5,17.2 46.7,28 46.7,30.65 arc90 45.85,31.5 44.16,31.5 arc45 43.37,31.17 40.19,27.99 arc-45 39.49,27.7 17.42,27.7 arc90 16.2,26.48 16.2,22.65 arc90
BUTTON  (1 unrouted)
  Top 0.254: R5.1 15.37,18.53 | 17.05,18.36 arc45 17.5,18.55 C4.1 18.04,19.04 18.32,19.32 arc-45 18.52,19.4 18.72,19.4 arc-45 18.86,19.34 21.64,16.56 arc45 22,16.41 23.25,16.41 arc45 23.61,16.56 24.83,17.78 arc-45 25.36,18 29.62,18 arc90 30.15,18.53 30.15,21.11 arc45 29.95,21.58 U1.66
CAN_RX  (via drill 0.2)
  Top 0.254: U1.91 31.76,12.29 arc-45 32.26,12.5 v32.6,12.5 | v42.1,4.5 CAN-RX.TP | U1.81 29.07,16.67 arc-45 29.14,16.7 v29.2,16.7
  Route15 0.254: v32.6,12.5 32.6,10.14 arc45 32.98,9.22 | 32.98,9.22 36.63,5.57 arc45 37.28,5.3 40.89,5.3 arc-45 41.59,5.01 v42.1,4.5 | v29.2,16.7 29.2,13.26 arc45 29.39,12.81 32.98,9.22
CAN_TX  (via drill 0.2, 0.3)
  Top 0.254: U1.82 27.2,14.1 v27,14.1 | U1.92 30.7,10.53 v30.7,10.3 | v40.5,4.4 CAN-TX.TP
  Route15 0.254: v40.5,4.4 36.96,4.4 arc-45 36.35,4.65 v30.7,10.3 30.7,10.4 v27,14.1
ENCODER-CS  (via drill 0.2)
  Top 0.254: v36,28.4 34.88,28.4 U1.51
  Bottom 0.254: U2.21 35.17,38.54 arc-90 35.63,39 39.23,39 arc-90 39.8,38.43 39.8,32.05 arc-90 39.35,31.6 36.25,31.6 arc90 35.8,31.15 35.8,28.6 v36,28.4
ENCODER-SCK  (via drill 0.2)
  Top 0.254: v34.8,26.65 34.78,26.65 U1.52
  Bottom 0.254: U2.10 35.18,27.03 v34.8,26.65
ENCODER-SDI  (via drill 0.2)
  Top 0.254: v34.4,28.9 33.59,28.9 arc45 33.44,28.84 33.36,28.76 arc-45 33.22,28.7 32.47,28.7 arc45 32.35,28.65 32.13,28.43 arc90 32.13,27.86 33.23,26.77 U1.54
  Bottom 0.254: U2.11 34.53,29.03 v34.4,28.9
ENCODER-SDO  (via drill 0.2)
  Top 0.254: v32.7,28.1 32.7,28.02 U1.53
  Bottom 0.254: U2.12 33.88,29.62 arc-45 33.64,29.04 v32.7,28.1
GND  (via drill 0.2, 0.3)  (220 unrouted)
  Top 0.254: U3.59 40.3,54.4 | U3.8 37.65,50.29 arc-45 37.76,50.56 v38.65,51.45 | U3.21 42.95,50.21 arc45 42.78,50.62 v41.95,51.45 | U1.99 35.02,9.9 arc45 35.2,10.32 v35.2,11.4 | U1.27 47.19,22.07 arc90 47.19,22.51 46.77,22.93 C50.2 | U1.74 27.1,18.77 v27.1,18.7
  Top 0.305: v25,35.2 24.65,34.85 PS1.4 | 40.3,54.4 40.85,54.4 v40.85,54.45 | PS1.15 25.15,36.15 v25,36 | PS1.14 25.65,36.15 v25.8,36 | v26.2,27.7 25.5,27.7 arc90 25.1,27.3 25.1,26.8 arc90 U5.3 | Y2.4 45.5,12.38 v45.5,12.2 | U1.10 39.33,12.2 v38.7,12.2 | C41.2 32.4,29.9 32.4,31.9 arc-90 32.7,32.2 PS4.3 | U4.6 23.9,11.07 v23.9,10.9 | U1.49 38.4,28.83 arc45 38.57,29.24 C52.2
  Top 0.406: C13.2 arc-90 45.7,62 v45.7,61.6 | C25.2 C14.2 C22.2
  Top 0.61: C6.2 C5.2 35.9,41.8 | 35.9,41.8 C12.2 | PS2.2 35.9,41.8 | C23.2 C19.2 35.9,34.9 | 35.9,34.9 C29.2 | PS3.2 37.8,34.9 35.9,34.9 | C54.2 22.53,23.27 C53.2
  Top 0.813: R6.1 arc90 30,48.3 C20.2 | R4.1 arc-90 50.5,48.3 C24.2
  Bottom 0.305: U2.20 34.52,36.48 U2.25 33.87,33.87 U2.13
  other vias: 25.8,35.2 38.65,55.45 39.75,55.45 40.85,55.45 41.95,55.45 38.65,54.45 39.75,54.45 41.95,54.45 38.65,53.45 39.75,53.45 40.85,53.45 41.95,53.45 38.65,52.45 39.75,52.45 40.85,52.45 41.95,52.45 39.75,51.45 40.85,51.45 18,36 18.8,36 18,35.2 18.8,35.2 18,34.4 18.8,34.4 18,33.6 18.8,33.6 10.4,56.7 11.2,56.7 11.2,55.9 17.6,56 18.4,56 17.6,55.2 18.4,55.2 17.6,54.4 18.4,54.4 17.6,53.6 18.4,53.6 25.9,56 26.7,56 25.9,55.2 26.7,55.2 25.9,54.4 26.7,54.4 25.9,53.6 26.7,53.6 29.4,50.2 30.2,50.2 31,50.2 31.8,50.2 48.6,50.2 49.4,50.2 50.2,50.2 51,50.2 40.9,67.6 41.7,67.6 46.5,61.6 30.1,8.5 30.9,8.5 30.1,7.7 30.9,7.7 34.4,13.8 35.2,13.8 34.4,13 35.2,13 34.4,12.2 35.2,12.2 34.4,11.4 34.5,41.6 34.5,40.8 28.3,59.5 28.3,58.7 28.3,57.9 28.3,57.1 31,37.2 31,36.4 35.9,36.4 34.1,35 34.1,34.2 34.1,36.4 35,46.3 35.8,46.3 17.8,20.8 18.6,20.8 19.4,20.8 26.1,29 26.9,29 26.9,28.2 17.8,28.7 18.6,28.7 19.4,28.7 20.2,28.7 44.5,11 57.3,41.3 58.1,41.3 57.3,40.5 58.1,40.5 57.3,39.7 58.1,39.7 57.3,38.9 58.1,38.9 58.1,33.4 54.5,33.5 55.3,33.5 24.5,10.3 25.1,9.7 48.1,22.7 47.7,21.9 45.9,65.2 46.7,65.2 45.9,64.4 46.7,64.4 43.9,65 43.9,64.2 34.3,20.4 35.1,20.4 34.3,19.6 35.1,19.6 54.5,32.7 28.4,65.7 29.2,65.7 28.4,64.9 29.2,64.9 28.4,64.1 29.2,64.1 28.4,63.3 29.2,63.3 25.5,68 26.3,68 25.5,67.2 26.3,67.2 57.4,60 58.2,60 57.4,59.2 58.2,59.2 3.4,31.5 4.2,31.5 3.4,30.7 4.2,30.7 3.4,29.9 4.2,29.9 3.4,29.1 4.2,29.1 3.4,43.1 4.2,43.1 3.4,42.3 4.2,42.3 3.4,41.5 4.2,41.5 3.4,40.7 4.2,40.7 35,66.7 35.8,66.7 35,65.9 35.8,65.9 35.9,35
  pour Top (isolate 0.305, rank 2): 71,35 arc-90 36,0 35.5,0 arc-90 0,35.5 arc-90 35.5,71 arc-90 71,35.5
  pour Bottom (isolate 0.305, rank 2): 71,35 arc-90 36,0 35.5,0 arc-90 0,35.5 arc-90 35.5,71 arc-90 71,35.5
  pour Route2 (isolate 0.305, rank 2): 71,35 arc-90 36,0 35.5,0 arc-90 0,35.5 arc-90 35.5,71 arc-90 71,35.5
  pour Route15 (isolate 0.305, rank 2): 71,35 arc-90 36,0 35.5,0 arc-90 0,35.5 arc-90 35.5,71 arc-90 71,35.5
IMU-CS
  Top 0.254: U1.83 26.38,12.57 U4.12
IMU-INT1  (via drill 0.3)
  Top 0.254: v23.15,13.1 23.24,13.1 U4.4 | U1.84 27.43,12.91 arc45 27.3,12.6 v27.3,12.35
  Bottom 0.254: v23.15,13.1 23.77,12.47 arc45 24.08,12.35 v27.3,12.35
IMU-INT2
  Top 0.254: U1.85 28.4,13.18 arc45 28.3,12.93 28.3,12.65 arc45 28.41,12.39 29.02,11.78 arc-90 29.02,11.22 28.08,10.28 arc-90 27.52,10.28 26.89,10.91 arc45 26.68,11 26.15,11 arc-45 25.97,11.08 U4.9
IMU-SCK  (via drill 0.3)
  Top 0.254: U1.78 25.51,15.24 arc-45 25.42,15.2 v25.05,15.2 | v26.25,13.45 25.76,12.96 U4.13
  Bottom 0.254: v25.05,15.2 25.05,14.76 arc45 25.12,14.57 v26.25,13.45
IMU-SDI
  Top 0.254: U1.80 25.41,13.72 U4.14
IMU-SDO
  Top 0.254: U1.79 24.83,13.85 U4.1
LED-HV
  Top 0.254: R8.1 61.25,25.55 arc90 Q1.3 63.2,24.8
LED-PC8  (via drill 0.2)
  Top 0.254: U1.65 34.39,17.84 arc45 35.23,17.5 36.5,17.5 v36.6,17.4
  Bottom 0.254: 52.7,20.5 arc90 52.4,20.2 52.4,14.9 arc-90 52,14.5 39.98,14.5 arc-45 39.67,14.63 36.9,17.4 v36.6,17.4
LED-PD8  (via drill 0.2)
  Top 0.254: 36.42,18.3 v36.6,18.3 36.47,18.3 arc-90 36,18.77 36,22.69 arc45 35.56,23.75 U1.55
  Bottom 0.254: 52.3,23.1 arc90 51.8,22.6 51.8,15.5 arc-90 51.3,15 40.47,15 arc-45 39.84,15.26 36.8,18.3 v36.6,18.3
LED-PE14  (via drill 0.2)  (1 unrouted)
  Top 0.254: 51.6,25.7 arc90 51.2,25.3 v51.2,23.2 | 37.9,25.5 U1.45 37,24.6 arc45 36.6,23.64 v36.6,19.2 | Q1.2 58.2,23.85 arc-90 R7.1
  Bottom 0.254: v51.2,23.2 51.2,15.9 arc-90 50.8,15.5 40.55,15.5 arc-45 40.12,15.68 v36.6,19.2
N$6
  Top 0.254: U6.2 22.1,27.82 arc-90 21.88,27.6 19.9,27.6 R30.2
N$8
  Top 0.254: R9.2 40.56,9.56 U1.8
N$9
  Top 0.254: R10.2 40.27,10.56 U1.9
N$10
  Top 0.254: L3.2 50.44,16.52 R12.1
N$11
  Top 0.254: R32.1 23.8,24.91 arc-45 23.44,25.06 23.25,25.25 arc45 22.89,25.4 21.94,25.4 arc-90 21.45,25.89 U6.4
N$12
  Top 0.254: C34.1 45.44,9.1 arc-45 44.86,9.34 43.91,10.29 arc-45 43.7,10.79 43.7,11.85 Y2.1 42.42,11.89 arc45 42.2,11.8 42.12,11.72 arc-45 41.83,11.6 41.48,11.6 arc-45 41.25,11.7 U1.12
N$13
  Top 0.254: C35.1 47.42,10.6 arc-45 47.19,10.7 Y2.3 45.27,11.43 43.83,12.87 arc45 43.52,13 42.93,13 arc45 42.71,12.91 41.87,12.06 arc-45 41.71,12 41.7,12 arc-45 41.62,12.03 U1.13
N$15
  Top 0.254: R27.1 PWR.A
N$20
  Top 0.254: R29.2 27.33,26.23 arc-45 27.01,26.1 24.91,26.1 arc-90 24.5,26.51 U5.2
N$22
  Top 0.254: R31.1 U5.4
N$27
  Top 0.254: C32.1 44.17,5.3 Y1.2 42.98,6.64 R9.1
N$28
  Top 0.254: R10.1 44.34,8.26 Y1.1 45.8,7.2 C33.1
N$29
  Top 0.254: R26.1 FLAG.A
N$36
  Top 0.254: C3.1 47.6,62.45 arc90 47.15,62.9 44.5,62.9 arc90 44.1,62.5 44.1,62.01 arc-45 43.95,61.65 43.09,60.79 arc-45 42.88,60.7 42.69,60.7 arc45 42.53,60.63 41.1,59.2 U3.57
N$37
  Top 0.254: R15.1 R16.2
N$46
  Top 0.305: C55.1 27.25,11.34 arc-45 27.02,11.44 U4.11
N$47
  Top 0.254: R28.1 BUSY.A
N$48
  Top 0.254: 58.95,36.65 D2.4 59.4,36.3 62.5,36.3 62.5,33.74 arc-90 61.86,33.1 60.9,33.1 arc90 60.4,32.6 60.4,31.07 arc-90 59.83,30.5 R20.1
N$49
  Top 0.254: R19.1 D2.3 59.05,35.11 arc-90 59.44,35.5
N$78
  Top 0.254: D3.3 49.8,60.3
  Top 0.305: 49.8,60.3 C3.2
N$83
  Top 0.254: R14.2 43.98,22.98 arc45 43.78,22.9 U1.33
N$84
  Top 0.254: R13.2 43.7,23.52 U1.34
N$85
  Top 0.254: R11.2 42.78,23.45 arc-45 42.68,23.21 U1.35
N$89
  Top 0.254: U3.56 41.83,59.33 42.61,60.11 arc-45 42.83,60.2 43.03,60.2 arc45 43.32,60.32 44,61 46.28,61 arc-90 46.6,60.68 46.6,59.96 arc90 46.96,59.6 48.02,59.6 arc-45 48.33,59.47 48.85,58.95 arc45 49.21,58.8 52.32,58.8 arc-90 52.6,58.52 C7.2
  Top 0.305: D3.2 52.2,57.75 C7.2
N$101
  Top 0.305: C26.2 29.11,35.43 arc-45 28.91,35.35 PS1.10
NRST  (via drill 0.2)
  Top 0.254: U1.14 40.1,14.26 arc45 39.76,14.4 36.46,14.4 arc90 36.1,14.04 v36.1,13.7 | v35.5,8.2 NRST.TP
  Bottom 0.254: C59.1 v36.1,13.7 36.1,8.97 arc-45 35.98,8.68 v35.5,8.2
OUTA1  (via drill 0.3)
  Top 0.254: v43.6,55.5 43.57,55.53 U3.53 | v45.4,55.5 45.81,55.91 U3.42 | v45.4,54.1 45.78,53.72 U3.38
  Top 0.305: U3.EPAD4 44.54,54.8 v44.5,54.8
  other vias: 44.5,55.5 43.6,54.8 45.4,54.8 43.6,54.1 44.5,54.1
  pour Bottom (isolate 0.305, no thermals): 47.61,60.79 48.33,60.07 arc-45 48.5,59.66 48.5,54.12 arc-90 48.08,53.7 43.42,53.7 arc-90 43.1,54.02 43.1,55.54 arc-90 43.46,55.9 46.7,55.9 arc90 47.2,56.4 47.2,58.62 arc90 46.62,59.2 36.34,59.2 arc-90 35.7,59.84 35.7,64.84 arc-90 36.06,65.2 37.54,65.2 arc-90 37.9,64.84 37.9,61.63 arc90 38.63,60.9 47.35,60.9 arc-45
OUTA2  (via drill 0.3)
  Top 0.254: v45.4,52.7 45.78,53.08 U3.37 | v45.4,51.3 45.81,50.89 U3.33 | v43.6,51.3 43.57,51.27 U3.22
  Top 0.305: U3.EPAD3 44.54,52 v44.5,52
  other vias: 43.6,52.7 44.5,52.7 43.6,52 45.4,52 44.5,51.3
  pour Bottom (isolate 0.305, no thermals): 46.58,62.2 39.11,62.15 arc-90 38.4,62.86 38.4,64.8 arc-90 38.8,65.2 40.06,65.2 arc-90 40.6,64.66 40.6,63.91 arc90 40.96,63.55 47.82,63.55 arc-45 48.59,63.11 50.41,60.79 arc-45 50.8,59.85 50.8,51.4 arc-90 50.3,50.9 43.46,50.9 arc-90 43.1,51.26 43.1,52.82 arc-90 43.38,53.1 48.42,53.1 arc90 49.2,53.88 49.2,59.83 arc45 48.94,60.46 48.16,61.24 arc45
OUTB1  (via drill 0.3)
  Top 0.254: U3.76 34.91,55.91 U3.EPAD7 | U3.80 34.98,53.72 U3.EPAD7 | U3.65 37.03,55.77 U3.EPAD7
  Top 0.305: U3.EPAD7 36.06,54.8 v36.1,54.8
  other vias: 35.2,55.5 36.1,55.5 37,55.5 35.2,54.8 37,54.8 35.2,54.1 36.1,54.1 37,54.1
  pour Bottom (isolate 0.305, no thermals): 31.6,61.2 31.5,53.93 arc91 31.73,53.7 37.46,53.7 arc90 37.6,53.84 37.6,55.68 arc90 37.18,56.1 34.2,56.1 arc-90 33.7,56.6 33.7,61.2 arc-45 33.91,61.71 34.2,62 34.84,62.6 arc90 35.2,62.96 35.2,64.7 arc90 34.7,65.2 33.62,65.2 arc90 33.4,64.78 33.3,63.2
OUTB2  (via drill 0.3)
  Top 0.254: U3.81 34.97,53.08 U3.EPAD8 | U3.85 34.9,50.89 U3.EPAD8 | U3.7 37.03,51.02 U3.EPAD8
  Top 0.305: U3.EPAD8 36.05,52 v36.1,52
  other vias: 35.2,52.7 36.1,52.7 37,52.7 35.2,52 37,52 35.2,51.3 36.1,51.3 37,51.3
  pour Bottom (isolate 0.305, no thermals): 30.5,63.4 29.63,62.53 arc45 29.5,62.21 29.5,51.72 arc90 30.22,51 37.5,51 arc90 37.6,51.1 37.6,52.96 arc90 37.46,53.1 31.38,53.1 arc-90 30.8,53.68 30.8,61.4 32.71,63.31 arc45 32.8,63.52 32.8,64.7 arc90 32.3,65.2 30.92,65.2 arc90 30.5,64.78
POWERSTEP-BUSY  (via drill 0.2, 0.3)
  Top 0.254: U1.39 41.28,24.64 arc45 41.4,24.93 41.4,25.02 arc-45 41.53,25.33 43.32,27.12 arc-45 43.52,27.2 43.68,27.2 arc45 43.88,27.28 46.05,29.45 arc45 46.2,29.81 46.2,43.98 arc45 46.12,44.18 45.88,44.42 arc45 45.68,44.5 40.9,44.5 arc-90 v40.7,44.7 arc-90 40.5,44.9 U3.15 | v23.1,59.7 23.1,64.4 arc-90 23.4,64.7 25.8,64.7 arc90 26,64.9 BUSY.C
  Bottom 0.254: v40.7,44.7 22,44.7 arc-90 21.6,45.1 21.6,59.1 arc-90 21.9,59.4 22.8,59.4 arc90 v23.1,59.7
POWERSTEP-CS  (via drill 0.2)
  Top 0.254: U3.10 38.5,49.81 arc-45 38.56,49.97 v38.6,50 | v43.5,18.8 43.36,18.94 arc-45 43.3,19.08 43.3,19.38 arc-45 43.38,19.58 44.11,20.31 U1.29
  Bottom 0.254: v38.6,50 38.9,50.3 42.06,50.3 arc-90 42.7,49.66 42.7,44.31 arc45 43.2,43.1 53.16,33.14 arc-90 53.16,30.86 51.33,29.03 arc45 51.2,28.71 51.2,25.14 arc-90 50.56,24.5 49.22,24.5 arc45 48.84,24.34 43.5,19 v43.5,18.8
POWERSTEP-FLAG  (via drill 0.2, 0.3)
  Top 0.254: U1.38 40.98,23.58 41.74,24.34 arc45 41.8,24.48 41.8,24.82 arc-45 41.93,25.13 43.37,26.57 arc-45 43.62,26.67 43.85,26.67 arc45 44.05,26.75 46.61,29.31 arc45 46.7,29.53 46.7,44.17 arc45 46.61,44.39 46.13,44.87 arc45 45.81,45 41.6,45 arc-90 v41.1,45.5 arc-90 40.9,45.7 U3.16 | v22.3,58 22.3,65.2 arc-90 22.7,65.6 24.38,65.6 arc-90 FLAG.C
  Bottom 0.254: v41.1,45.5 22.7,45.5 arc-90 22.3,45.9 v22.3,58
POWERSTEP-SCK  (via drill 0.2)
  Top 0.254: U3.11 38.9,49.12 arc-45 38.96,49.26 39.4,49.7 v39.5,49.7 | v42.6,18.8 42.6,19.36 arc-45 42.77,19.77 U1.30 | v49.7,35.6 49.7,36.82 arc-90 49.98,37.1 51.61,37.1 arc45 51.77,37.16 52.84,38.24 PST-SCK.TP
  Bottom 0.254: v42.6,18.8 48.68,24.88 arc-45 48.98,25 50.13,25 arc90 50.7,25.57 50.7,28.99 arc-45 50.85,29.35 52.62,31.12 arc90 52.62,32.68 v49.7,35.6 42.59,42.72 arc-45 42.2,43.65 42.2,49.3 arc90 41.7,49.8 39.6,49.8 v39.5,49.7
POWERSTEP-SDI  (via drill 0.2)
  Top 0.254: U3.12 39.3,48.53 arc-45 39.42,48.82 v39.5,48.9 | v41.7,20.8 42.39,20.8 U1.32 | PST-SDI.TP 49.18,38.3 arc90 48.9,38.02 v48.9,34.8
  Bottom 0.254: v41.7,20.8 41.7,20.02 arc45 41.79,19.81 42.03,19.57 arc45 42.19,19.5 42.48,19.5 arc45 42.69,19.59 48.45,25.35 arc-45 48.81,25.5 49.57,25.5 arc90 50.2,26.13 50.2,29.22 arc-45 50.4,29.7 51.93,31.23 arc90 51.93,32.37 48.9,35.4 | v39.5,48.9 39.9,49.3 41.28,49.3 arc-90 41.7,48.88 41.7,42.99 arc45 41.98,42.32 48.9,35.4 | v48.9,34.8 48.9,35.4
POWERSTEP-SDO  (via drill 0.2)
  Top 0.254: 45.7,38.9 45.7,29.98 arc-45 45.64,29.84 v45.4,29.6 | 45.7,38.9 45.7,43.64 arc90 45.34,44 40.7,44 arc-90 40.1,44.6 U3.14 | U1.31 42.5,20.2 v42.4,20.2 | PST-SDO.TP 45.1,38.3 arc90 45.7,38.9
  Bottom 0.254: v45.4,29.6 49.03,29.6 arc-90 49.6,29.03 49.6,26.57 arc-90 49.03,26 48.38,26 arc45 48.07,25.87 v42.4,20.2
POWERSTEP-STBY  (via drill 0.2)
  Top 0.254: v48.2,26.8 48.2,40.9 | 48.2,40.9 48.2,44.68 arc45 48.04,45.06 46.72,46.38 arc45 46.43,46.5 42.78,46.5 arc-45 42.47,46.63 42.22,46.88 arc-45 42.1,47.17 U3.19 | v38.8,22.8 40.22,24.22 U1.40 | R1.1 48.65,41.35 arc90 48.2,40.9
  Bottom 0.254: v48.2,26.8 43.3,26.8 arc45 42.44,26.44 v38.8,22.8
POWERSTEP-STCK  (via drill 0.2)
  Top 0.254: v46.6,28.4 47.02,28.82 arc45 47.2,29.26 47.2,44.31 arc45 47.07,44.63 46.29,45.41 arc45 46.07,45.5 42.28,45.5 arc-45 41.97,45.63 41.39,46.21 arc-45 41.3,46.43 U3.17 | v49,28.4 49,22.35 arc-45 48.82,21.92 48.25,21.35 arc-45 47.89,21.2 47.29,21.2 arc45 46.85,21.02 U1.26
  Bottom 0.254: v49,28.4 v46.6,28.4
POWERSTEP-SW  (via drill 0.2)
  Top 0.254: v47.4,27.6 47.48,27.6 arc90 47.7,27.82 47.7,44.57 arc45 47.61,44.79 46.52,45.88 arc45 46.23,46 42.59,46 arc-45 42.27,46.13 41.82,46.58 arc-45 41.7,46.87 U3.18 | v38.8,23.6 38.83,23.6 U1.41
  Bottom 0.254: v47.4,27.6 43.17,27.6 arc45 42.54,27.34 v38.8,23.6
RX
  Top 0.254: R30.1 19.17,26.48 arc45 18.64,26.7 RX.TP
SENSEA
  Top 0.254: U3.20 42.5,47.42 arc45 42.59,47.21 42.71,47.09 arc45 42.93,47 46.67,47 arc-45 46.89,46.91 48.11,45.69 arc45 48.33,45.6 51.76,45.6 arc90 52.4,46.24 52.4,51.38 arc90 51.68,52.1 49.9,52.1 49.9,52.5
  Top 0.813: U3.39 49.9,54.82 R4.2 49.9,52.5 arc-90 49.4,52 47.09,52 U3.34
SENSEB
  Top 0.254: U3.9 38.1,47.3 arc-90 37.9,47.1 34.78,47.1 arc45 34.13,46.73 33.51,46.01 arc-45 33,45.8 28.64,45.8 arc-90 28.1,46.34 28.1,51.7 arc-90 28.6,52.2 31.33,52.2 31.33,52.1
  Top 0.813: U3.77 30.6,54.82 R6.2 30.6,52.83 arc90 31.33,52.1 33.51,52.1 U3.82
SYS-JTCK-SWCLK
  Top 0.254: U1.76 25.34,16.48 arc-45 25.16,16.4 24.43,16.4 arc45 24.03,16.23 23.03,15.23 arc-45 22.48,15 SWCLK.TP
SYS-JTDI
  Top 0.254: U1.77 25.53,15.96 arc-45 25.39,15.9 24.77,15.9 arc45 24.48,15.78 22.38,13.68 arc-45 21.95,13.5 19.48,13.5 arc45 19.17,13.37 JTDI.TP
SYS-JTDO-SWO  (via drill 0.3)
  Top 0.254: JTDO.TP 26.6,3.55 arc45 26.85,3.65 28.36,5.16 arc45 28.4,5.26 v28.4,5.4 | v32.6,14.4 32.45,14.4 U1.89
  Bottom 0.254: v32.6,14.4 29.01,10.81 arc45 28.8,10.3 28.8,5.8 arc-90 28.79,5.79 v28.4,5.4
SYS-JTMS-SWDIO  (via drill 0.2)
  Top 0.254: U1.72 27.7,19.59 v27.7,19.2 | v21.2,23.5 SWDIO.TP
  Bottom 0.254: v27.7,19.2 23.4,23.5 v21.2,23.5
SYS-JTRST  (via drill 0.3)
  Top 0.254: U1.90 32.07,13.31 arc-45 32.29,13.4 v32.6,13.4 | v29.4,5.2 29.4,3.6 JTRST.TP
  Bottom 0.254: v29.4,5.2 29.4,9.9 arc-45 29.61,10.41 v32.6,13.4
TX
  Top 0.254: TX.TP 26.68,31.12 arc-45 26.85,30.71 R31.2
UART-RX
  Top 0.254: U1.64 29.14,23.8 arc45 28.91,23.9 27.33,23.9 R32.2
UART-RX-ENABLE  (via drill 0.2)
  Top 0.254: U1.60 32.1,23.68 v32.1,23.6 | v22.75,29.2 U6.1
  Bottom 0.254: v32.1,23.6 25.07,23.6 arc-45 24.61,23.79 22.94,25.46 arc-45 22.75,25.92 v22.75,29.2
UART-TX
  Top 0.254: U1.63 29.17,24.48 arc-45 29.07,24.73 29.07,25.29 R29.1
UART-TX-ENABLE  (via drill 0.2)
  Top 0.254: U1.58 32.8,24.39 v32.8,24.3 | v23.85,25.95 U5.1
  Bottom 0.254: v32.8,24.3 25.79,24.3 arc-45 25.29,24.51 v23.85,25.95
USB-D+  (via drill 0.2)
  Top 0.254: R19.2 56.45,31.6 arc-45 56.27,31.53 50,31.53 v50,31.7 | v28.3,19.7 U1.71
  Bottom 0.254: v50,31.7 50,31.53 42.72,31.53 arc45 42.35,31.38 30.8,19.82 arc-45 30.34,19.63 28.37,19.63 v28.3,19.7
USB-D-  (via drill 0.2)
  Top 0.254: R20.2 56.86,30.99 arc45 56.66,31.07 50,31.07 v50,30.89 | v29.5,19 29.5,19.3 27.69,21.11 U1.70
  Bottom 0.254: v50,30.89 50,31.07 42.81,31.07 arc45 42.61,30.99 30.92,19.3 arc-45 30.61,19.17 29.67,19.17 v29.5,19
USB-ID  (via drill 0.2)
  Top 0.254: v57.1,35.2 arc-90 57.15,35.15 D2.1 54.92,32.12 arc-45 54.63,32 50.77,32 arc-45 50.31,32.19 v50,32.5 | v29.5,20.3 29.11,20.3 U1.69
  Bottom 0.254: 57.32,34.7 arc-90 57.1,34.92 v57.1,35.2 | v29.5,20.3 30.41,20.3 arc45 30.73,20.43 42.17,31.87 arc-45 42.48,32 49.09,32 arc45 49.45,32.15 49.8,32.5 v50,32.5
USB-VBUS  (via drill 0.2)
  Top 0.254: R21.2 R22.1 53.6,34.4 53.6,32.78 arc-90 53.32,32.5 51.09,32.5 arc-45 50.77,32.63 50.1,33.3 v50,33.3 | v29.5,21.1 29.02,21.1 U1.68
  Bottom 0.254: v50,33.3 49.9,33.3 49.22,32.62 arc-45 48.92,32.5 42.41,32.5 arc45 41.88,32.28 30.68,21.08 arc-45 30.48,21 29.5,21 v29.5,21.1
USB-VBUS-5V  (via drill 0.2)
  Top 0.254: R21.1 v56.4,36.7 56.45,36.65 D2.6
  Bottom 0.254: 56.54,37.1 arc90 56.4,36.96 v56.4,36.7
VCAP_1
  Top 0.305: C51.1 38.55,28.01 arc45 38.1,27.82 U1.48
VCAP_2
  Top 0.305: C54.1 25.06,21.79
  Top 0.406: U1.73 24.94,21.64 C54.1
VCC  (via drill 0.3)  (53 unrouted)
  Top 0.254: R15.2 16.55,28.05 arc90 16.9,28.4 16.9,31.2 arc-90 17,31.3 | U3.55 42.23,59.13 42.69,59.59 arc-45 43.2,59.8 45.6,59.8 | v16.4,48.5 16.4,48.59 arc90 C11.+ | v24.9,48.5 24.9,48.59 arc90 C10.+
  Top 0.305: PS1.11 27.79,35.85 arc45 27.98,35.92 v28.2,36.15 | D3.1 46.5,57.75 | 46.5,57.75 v46.5,57.5 | C7.1 46.5,56.45 v46.5,56.8 | 46.5,57.75 46.3,57.95 U3.43 | v36,50 35.8,49.8 U3.1 | v36,58.2 35.75,57.95 U3.66 | v44.7,50 U3.23
  Top 0.406: C9.1 arc-90 22.6,35.35 PS1.3 PS1.2 | JP1.1 42.95,64.65 arc90 v43,64.7
  Top 0.813: C18.1 34.8,57.8 v35.1,57.5 | 34,48.2 v35.1,49.3 | C13.1 45.6,59.8 v45.6,57.5 | C24.1 48.1,47 v46.5,48.6 | C20.1 32.6,47 v34.2,48.6
  Top 1.016: 15.9,38 arc-90 17,36.9 17,31.3 arc90 18.3,30 21.3,30 arc90 22,30.7 C8.1 v22,33.5 22,34.05 arc90 C9.1
  Route15 0.406: v43,64.7 43,63.36 arc45 43.32,62.58 C13.1
  Bottom 0.305: v28.2,36.15 28.2,33.55 arc-90 27.8,33.15 22.35,33.15 arc-90 v22,33.5
  other vias: 34.2,58.2 35.1,58.2 34.2,57.5 36,57.5 34.2,56.8 35.1,56.8 36,56.8 34.2,50 35.1,50 34.2,49.3 36,49.3 35.1,48.6 36,48.6 44.7,58.2 45.6,58.2 46.5,58.2 44.7,57.5 44.7,56.8 45.6,56.8 45.6,50 46.5,50 44.7,49.3 45.6,49.3 46.5,49.3 44.7,48.6 45.6,48.6 15.6,47.5 16.4,47.5 15.6,48.5 15.6,49.5 16.4,49.5 15.6,50.5 16.4,50.5 24.1,47.5 24.9,47.5 24.1,48.5 24.1,49.5 24.9,49.5 24.1,50.5 24.9,50.5
  pour Route15 (isolate 0.305, no thermals): 13.29,52.79 7.42,46.92 arc45 7,45.91 7,37.13 arc90 8.13,36 15.19,36 arc90 16,36.81 16,43.3 arc-90 17.2,44.5 54.37,44.5 arc45 54.59,44.59 55.38,45.38 arc45 55.5,45.68 55.5,59.22 arc90 54.22,60.5 44.5,60.5 43.5,59.5 43.5,56.5 44,56 46.38,56 arc-90 47.1,55.28 47.1,51.5 arc-90 46.6,51 44,51 43.5,50.5 43.5,48.58 arc-90 42.92,48 37.01,48 arc-90 36.5,48.51 36.5,50.5 36,51 34.22,51 arc-90 33.4,51.82 33.4,55.22 arc-90 34.18,56 36.5,56 37,56.5 37,59 36,60 15.06,60 arc90 14,58.94 14,54.5 arc-45
VCC-POWERSTEP
  Top 0.254: U3.58 40.7,59.41
  Top 0.305: 40.7,59.41 arc-45 40.77,59.56 42.2,61 C15.1 43.09,61.55 arc45 43.2,61.6 43.56,61.96 arc45 43.6,62.06 43.6,62.8 arc-90 44.2,63.4 44.5,63.4 arc90 44.9,63.8 JP3.1
VCCREG
  Top 0.254: U3.60 39.9,60.15
  Top 0.305: 39.9,60.15 C25.1 arc90 40.25,60.6 40.8,60.6 arc90 41.2,61 41.2,65 arc-90 41.7,65.5 43.38,65.5 arc45 43.58,65.58 44.22,66.22 arc-45 44.53,66.35 JP3.2
VDD
  Top 0.305: 24.2,60.75 arc90 R26.2 R28.2 arc90 26.3,60.65 JP2.2 27.5,45.87 arc90 28.17,45.2 38.8,45.2 arc90 39,45.4 C17.1 | 39.7,46.9 arc-90 C17.1 | U3.13 39.7,46.9 | 39.7,46.9 arc-90 C17.1
VDDA  (via drill 0.2)
  Top 0.254: R12.2 46.9,16.41 arc45 46.58,16.28 45.59,15.29 arc-45 45.37,15.2 44.91,15.2 arc-45 44.75,15.26 U1.22
  Top 0.305: U1.22 43.22,16.8 v43.2,16.8
  Bottom 0.305: C48.1 40.57,16.5 C46.1 42.06,17.94 v43.2,16.8
VREG
  Top 0.254: U3.62 38.45,59.35 arc90 38.2,59.6 36.5,59.6 arc-90 36.2,59.9 C22.1
  Top 0.305: C16.1 33.9,61.9 arc90 33.4,62.4 27.55,62.4 arc90 JP2.1
  Top 0.813: C22.1 34.25,60.65 C16.1
VSREG  (via drill 0.3)
  Top 0.305: C14.1 38.76,60.65 arc-45 38.91,60.59 39.16,60.34 arc-45 39.2,60.24 39.2,58.87 U3.61
  Top 0.406: JP1.2 42.15,66.4 v41.4,66.4 | v39.15,61.55 39.1,61.55 C14.1
  Route15 0.406: v41.4,66.4 41.4,62.01 arc-90 40.94,61.55 v39.15,61.55
VSW
  Top 0.305: PS1.16 23.91,37.09 | 23.91,37.09 22.3,37.09 D1.1 | PS1.1 23.91,37.09 | C26.1 29.5,37.09 26.89,37.09 | 26.89,37.09 PS1.13 | PS1.12 26.89,37.09
  Top 0.406: PS1.16 24.65,38.92 arc-90 L1.1 arc-90 26.15,38.92 PS1.13

## Text on the board
tPlace: Prototype | V0.2 | PE14 | PD8 | PC8 | Temp